# Altium schematic sheet miniGateway.SchDoc
size A3; SheetNumber: 1; SheetTotal: 1
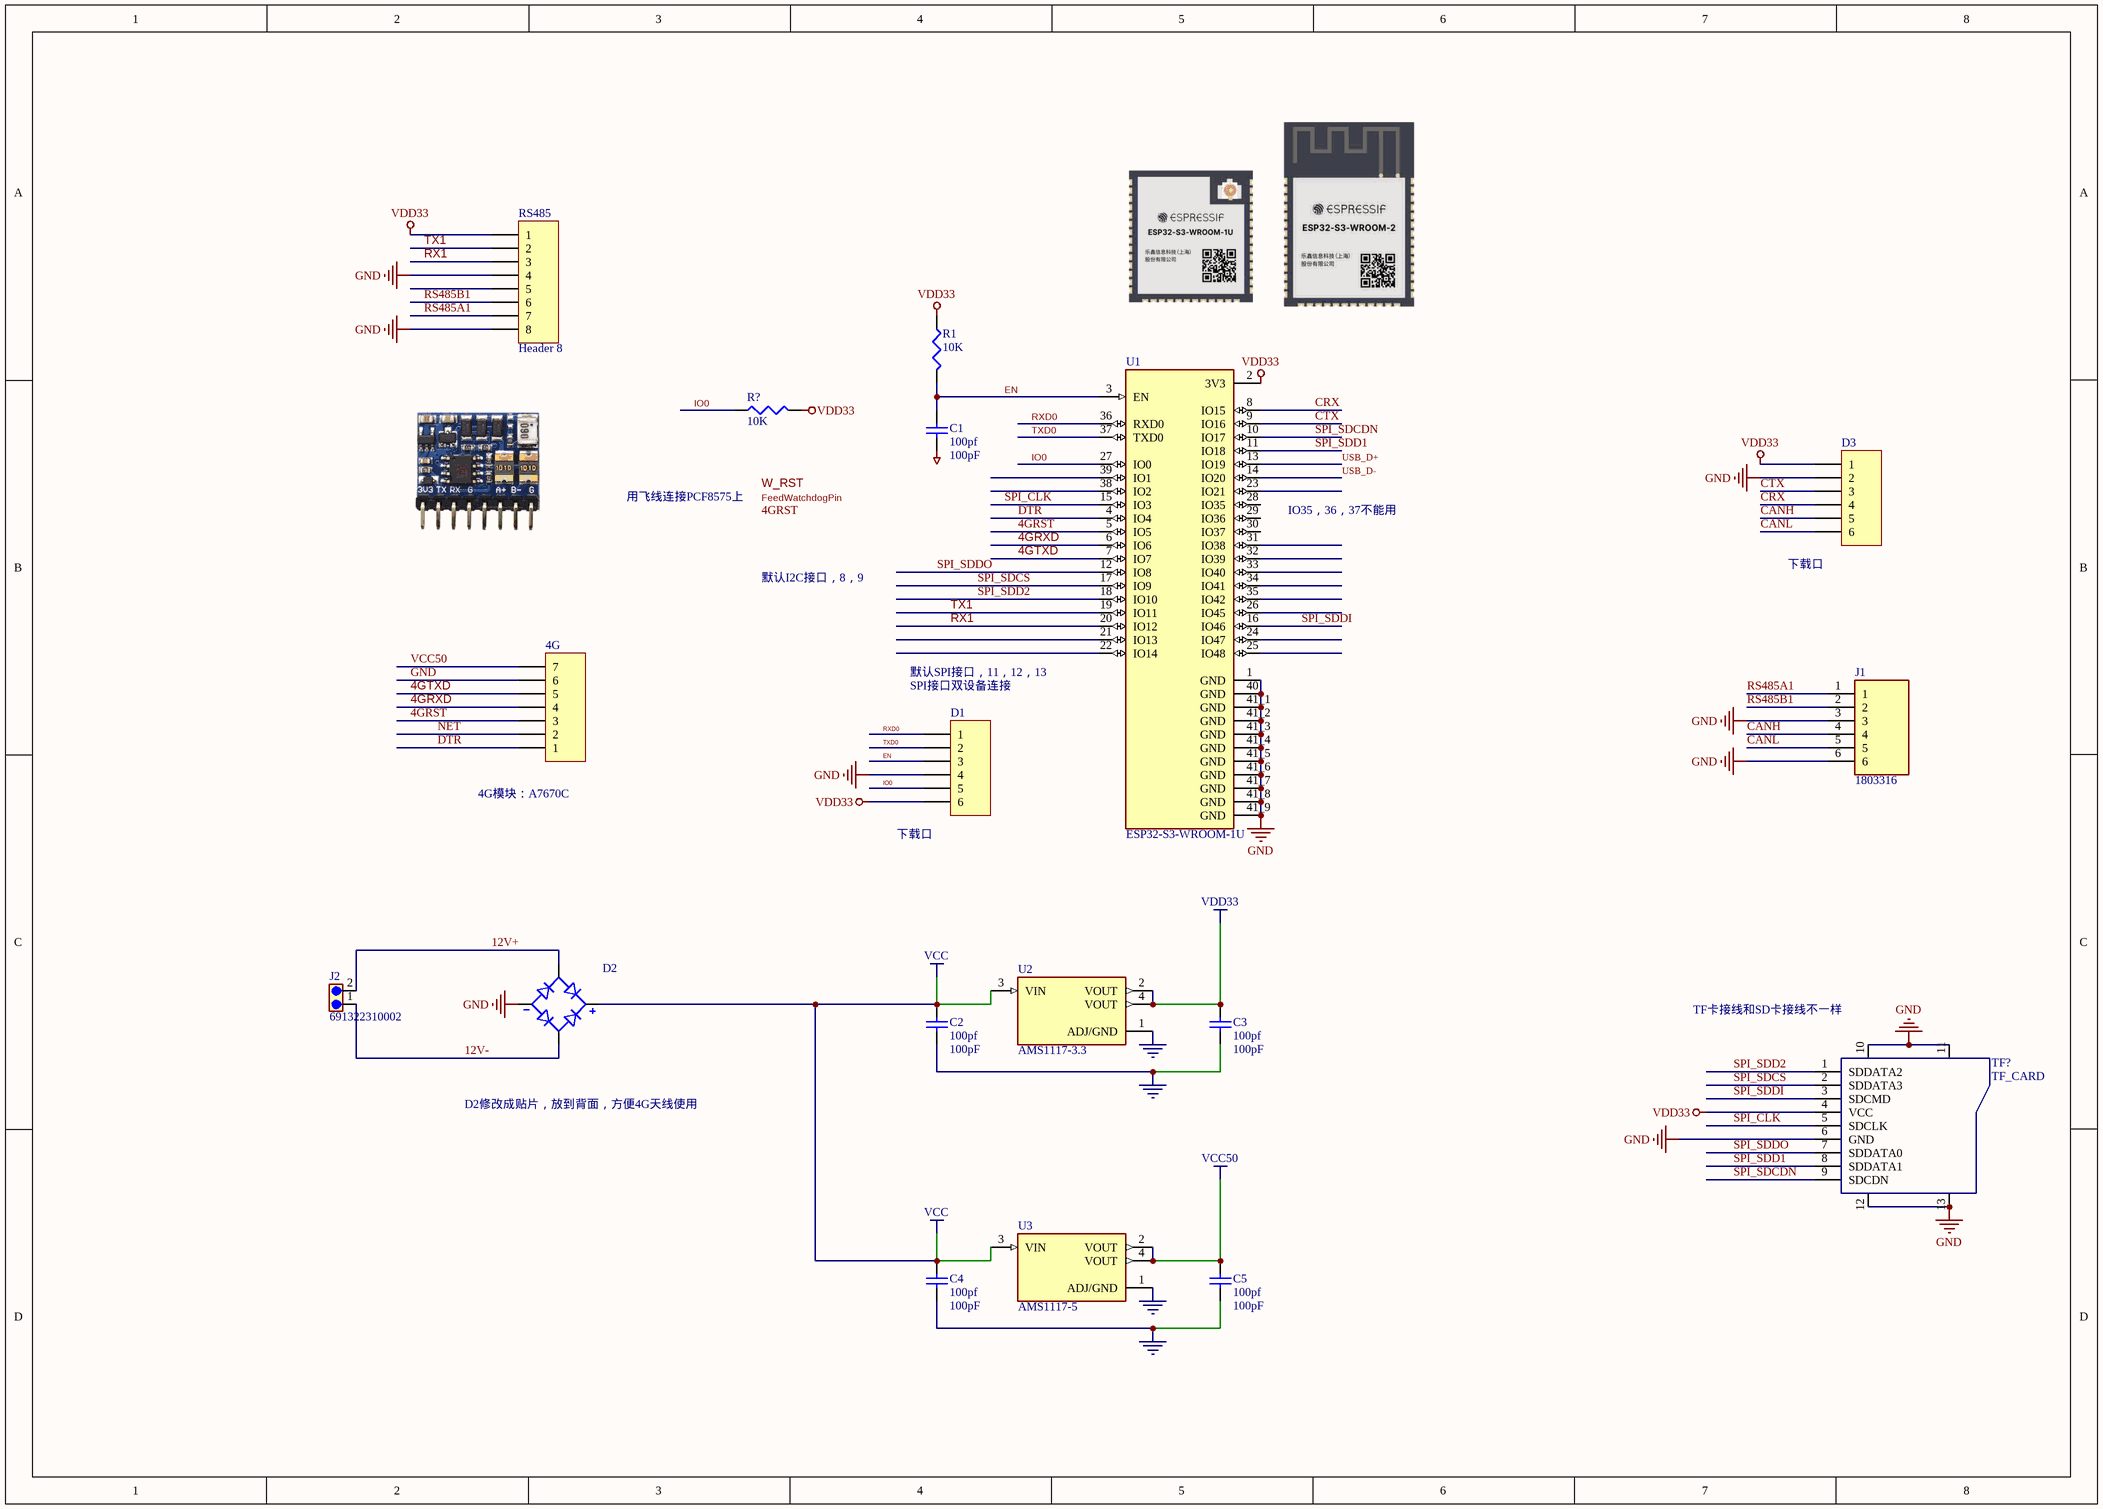
[diagram p0: miniGateway.SchDoc]

## Parts
4G  DS1307模块  [DS1307]  (value not drawn)
C1  100pf  [0805]
C2  100pf  [0805]
C3  100pf  [0805]
C4  100pf  [0805]
C5  100pf  [0805]
D1  2.54DIP6  [HDR1X6]  (value not drawn)
D2  HD06-T  [DQ]  (value not drawn)
D3  2.54DIP6  [HDR1X6]  (value not drawn)
J1  1803316  [6PIN3.81mm]
J2  691322310002  [691322310002]
R1  10K  [0805]
R?  10K  [0805]
RS485  Header 8  [HDR1X8]
TF?  TF_CARD  [TF_SOCKET-1]
U1  ESP32-S3-WROOM-1U  [ESP32-S3-WROOM]
U2  AMS1117-3.3  [SOT229P700X180-4N]
U3  AMS1117-5  [SOT229P700X180-4N]

## Nets
GND: 4G.6 C1.1 C2.1 C3.1 C4.1 C5.1 D1.4 D2.NEG D3.2 J1.3 J1.6 RS485.4 RS485.8 TF?.6(GND) TF?.10 TF?.11 TF?.12 TF?.13 U1.1(GND) U1.40(GND) U1.41_1(GND) U1.41_2(GND) U1.41_3(GND) U1.41_4(GND) U1.41_5(GND) U1.41_6(GND) U1.41_7(GND) U1.41_8(GND) U1.41_9(GND) U2.1(ADJ/GND) U3.1(ADJ/GND)
VCC: C2.2 C4.2 D2.POS U2.3(VIN) U3.3(VIN)
VCC50: 4G.7 C5.2 U3.2(VOUT) U3.4(VOUT)
VDD33: C3.2 D1.6 D3.1 R1.1 R?.2 RS485.1 TF?.4(VCC) U1.2(3V3) U2.2(VOUT) U2.4(VOUT)
4GRST: 4G.3 U1.5(IO5)
4GRXD: 4G.4 U1.6(IO6)
4GTXD: 4G.5 U1.7(IO7)
12V+: D2.AC2 J2.2
12V-: D2.AC1 J2.1
CANH: D3.5 J1.4
CANL: D3.6 J1.5
CRX: D3.4 U1.8(IO15)
CTX: D3.3 U1.9(IO16)
DTR: 4G.1 U1.4(IO4)
EN: C1.2 D1.3 R1.2 U1.3(EN)
IO0: D1.5 R?.1 U1.27(IO0)
NET: 4G.2
RS485A1: J1.1 RS485.7
RS485B1: J1.2 RS485.6
RX1: RS485.3 U1.20(IO12)
RXD0: D1.1 U1.36(RXD0)
SPI_CLK: TF?.5(SDCLK) U1.15(IO3)
SPI_SDCDN: TF?.9(SDCDN) U1.10(IO17)
SPI_SDCS: TF?.2(SDDATA3) U1.17(IO9)
SPI_SDD1: TF?.8(SDDATA1) U1.11(IO18)
SPI_SDD2: TF?.1(SDDATA2) U1.18(IO10)
SPI_SDDI: TF?.3(SDCMD) U1.16(IO46)
SPI_SDDO: TF?.7(SDDATA0) U1.12(IO8)
TX1: RS485.2 U1.19(IO11)
TXD0: D1.2 U1.37(TXD0)
USB_D+: U1.13(IO19)
USB_D-: U1.14(IO20)

Not connected (* = marked no-connect by the designer): RS485 5; U1 21(IO13) 22(IO14) 23(IO21) 24(IO47) 25(IO48) 26(IO45) 28(IO35) 29(IO36) 30(IO37) 31(IO38) 32(IO39) 33(IO40) 34(IO41) 35(IO42) 38(IO2) 39(IO1)

## Notes on the sheet
- 用飞线连接PCF8575上
- IO35，36，37不能用
- 默认I2C接口，8，9
- (near D3) 下载口
- 默认SPI接口，11，12，13
- (near D1) SPI接口双设备连接
- (near 4G) 4G模块：A7670C
- (near D1) 下载口
- TF卡接线和SD卡接线不一样
- D2修改成贴片，放到背面，方便4G天线使用
- Labels drawn without touching a wire or pin: 4GRST, FeedWatchdogPin, W_RST

## Library data of the parts
4G = Header 7: Header, 7-Pin; LatestRevisionDate: 17-Jul-2002; LatestRevisionNote: Re-released for DXP Platform.; Publisher: Altium Limited
C1-C5 = Cap Semi: Capacitor (Semiconductor SIM Model); Published: 8-Jun-2000; LatestRevisionDate: 29-May-2009; LatestRevisionNote: IPC-7351 Footprint Added.; PackageReference: C1206; Publisher: Altium Limited; PackageDescription: Chip Capacitor; Value: 100pF
D1 D3 = Header 6: Header, 6-Pin; LatestRevisionDate: 17-Jul-2002; LatestRevisionNote: Re-released for DXP Platform.; Publisher: Altium Limited
D2 = HD06-T: KÃ¶prÃ¼ DoÄŸrultucu Tek FazlÄ± Standart 600 V YÃ¼zey MontajlÄ± 4-MiniDIP; MF: Diodes Inc.; Price: None; Purchase-URL: https://pricing.snapeda.com/search/part/HD06-T/?ref=eda; Availability: In Stock; Package: SMD-4 Diodes Inc.; Check_prices: https://www.snapeda.com/parts/HD06-T/Diodes+Inc./view-part/?ref=eda; SnapEDA_Link: https://www.snapeda.com/parts/HD06-T/Diodes+Inc./view-part/?ref=snap; Value: *; MP: HD06-T
J1 = 1803316: 6 Position Terminal Block Header, Male Pins, Shrouded _4 Side_ 0.150 _3.81mm_ 90Â°, Right Angle Through Hole; MF: Phoenix Contact; Price: None; Availability: Unavailable; Package: None; SnapEDA_Link: https://www.snapeda.com/parts/1803316/Phoenix%20Contact/view-part/681506/?ref=snap; MP: 1803316; Value: *
J2 = 691322310002: 2 Position Terminal Block Header, Male Pins, Shrouded (4 Side) 0.150 (3.81mm) 90Â°, Right Angle - Through Hole; MF: Wurth Electronics; SnapEDA_Link: https://www.snapeda.com/parts/691322310002/Wurth+Electronics+Inc./view-part/?ref=snap; Package: None; Value: *; MP: 691322310002; Check_prices: https://www.snapeda.com/parts/691322310002/Wurth+Electronics+Inc./view-part/?ref=eda
R1 R? = Res3: Resistor; Published: 8-Jun-2000; LatestRevisionDate: 29-May-2009; LatestRevisionNote: IPC-7351 Footprint Added.; PackageReference: J1-0603; Publisher: Altium Limited; PackageDescription: Chip Resistor; Value: 10K
RS485 = Header 8: Header, 8-Pin; LatestRevisionDate: 17-Jul-2002; LatestRevisionNote: Re-released for DXP Platform.; Publisher: Altium Limited
U1 = ESP32-S3-WROOM-1U: 2.4 GHz Wi-Fi (802.11 b/g/n) and Bluetooth 5 (LE) module; MF: Espressif Systems; SnapEDA_Link: https://www.snapeda.com/parts/ESP32-S3-WROOM-1U/Espressif+Systems/view-part/?ref=snap; Availability: Not in stock; Package: Package; Price: None; MP: ESP32-S3-WROOM-1U; Value: *; Check_prices: https://www.snapeda.com/parts/ESP32-S3-WROOM-1U/Espressif+Systems/view-part/?ref=eda
U2 U3 = AMS1117: 1A LOW DROPOUT VOLTAGE REGULATOR SOT-223; MF: Advanced Monolithic Systems; Price: None; Availability: Not in stock; Package: SOT-223 Seeed Technology; MP: AMS1117; Value: *; SnapEDA_Link: https://www.snapeda.com/parts/AMS1117/Advanced+Monolithic+Systems/view-part/?ref=snap; Check_prices: https://www.snapeda.com/parts/AMS1117/Advanced+Monolithic+Systems/view-part/?ref=eda